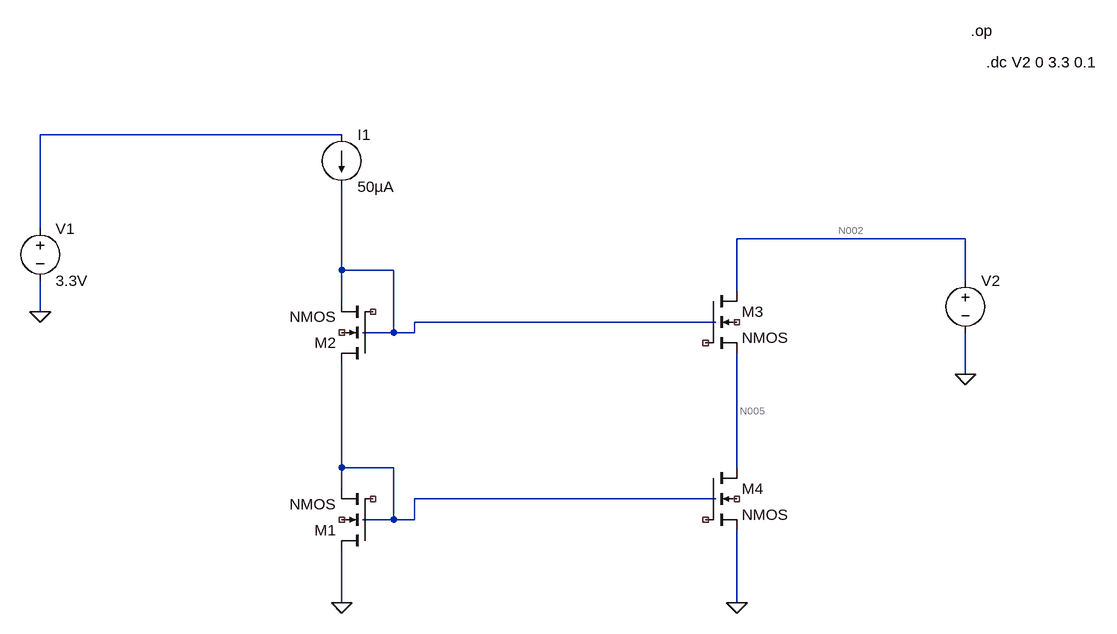
[diagram p0: schematic currentmirror.asc]
* currentmirror.asc
* M1: NMOS l=100u w=100u (symbol nmos4 not certain, pin order unknown); nets seen at it: 0, N004
* M2: NMOS l=100u w=100u (symbol nmos4 not certain, pin order unknown); nets seen at it: N003, N004
* M3: NMOS l=100u w=100u (symbol nmos4 not certain, pin order unknown); nets seen at it: N002, N005
* M4: NMOS l=100u w=100u (symbol nmos4 not certain, pin order unknown); nets seen at it: 0, N005
V1 N001 0 3.3V
V2 N002 0
I1 N001 N003 50µA
.op
.dc V2 0 3.3 0.1
.backanno
.end

* Results of the author's LTspice run, read from the files saved beside the schematic
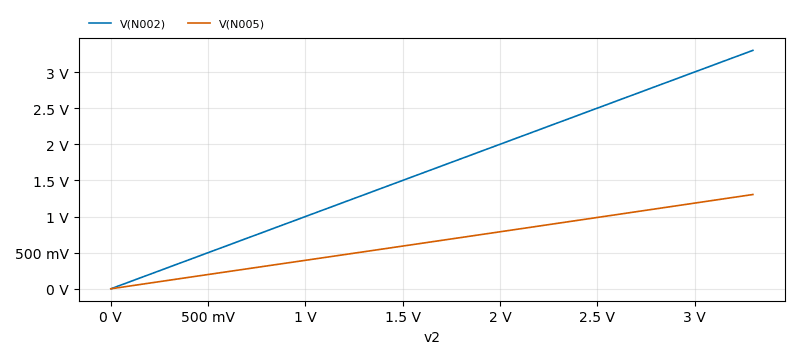
[diagram p1: DC transfer characteristic of currentmirror.asc, plotted from the saved traces]
* DC transfer characteristic, 1 run:
*   V(N002): 0 V at v2=0 V, 3.3 V at v2=3.3 V, min 0 V, max 3.3 V
*   V(N005): -4.098e-07 fV at v2=0 V, 1.305 V at v2=3.3 V, min -4.098e-07 fV, max 1.305 V